# EAGLE board rev02 (EAGLE 7.5.0), part 1 of 2
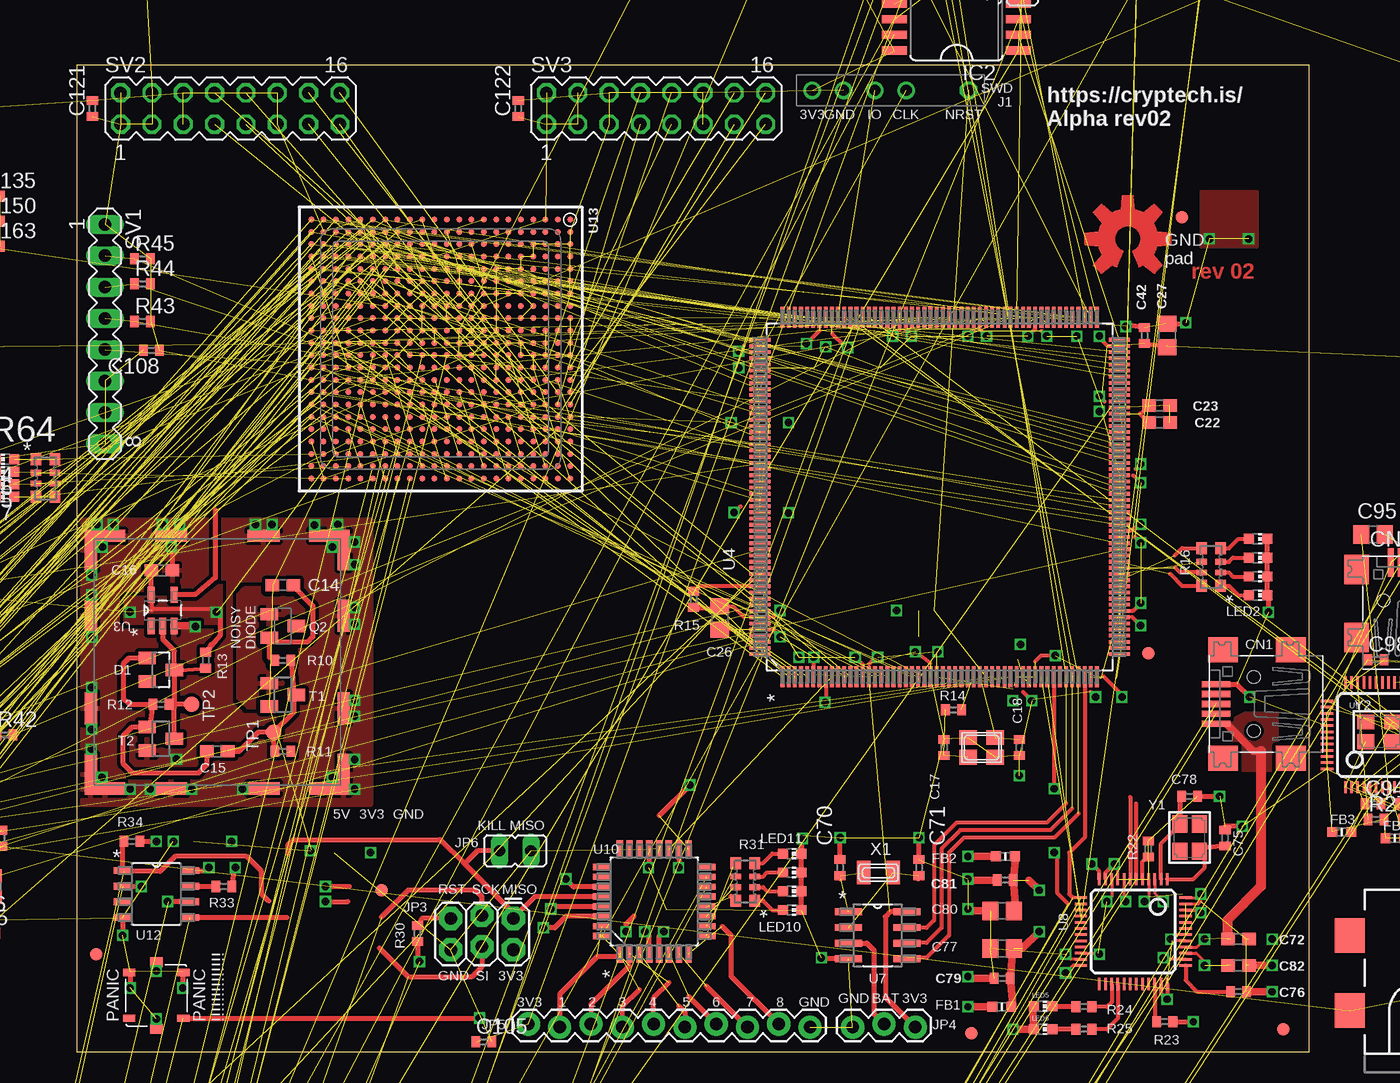
[diagram p26: board, top side]
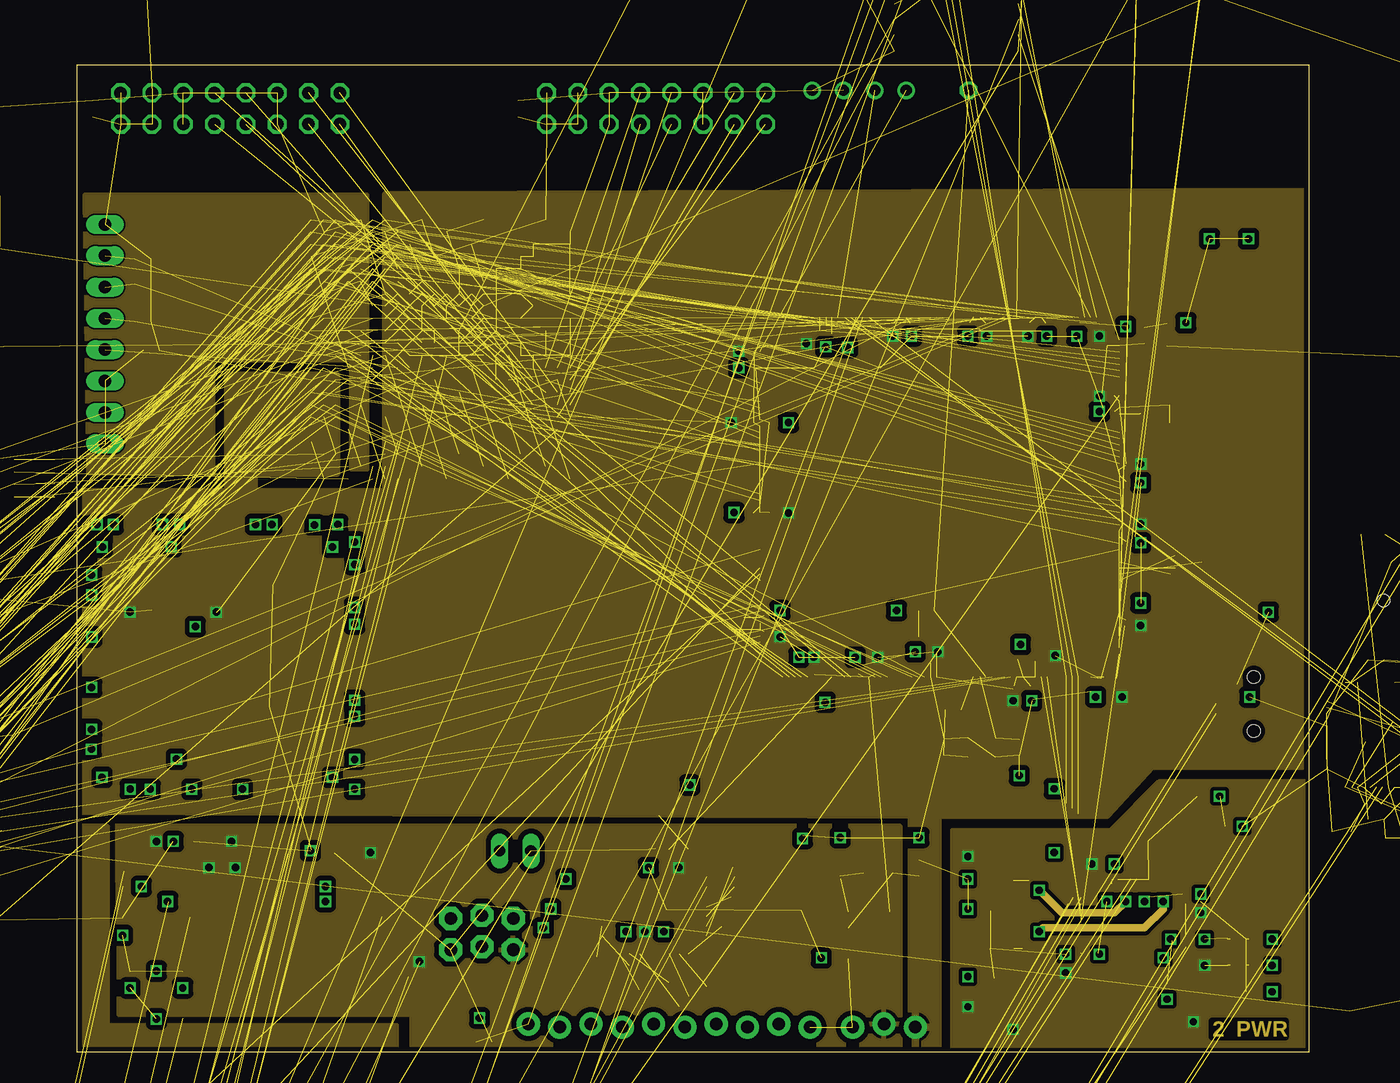
[diagram p27: board, inner layer POWER]
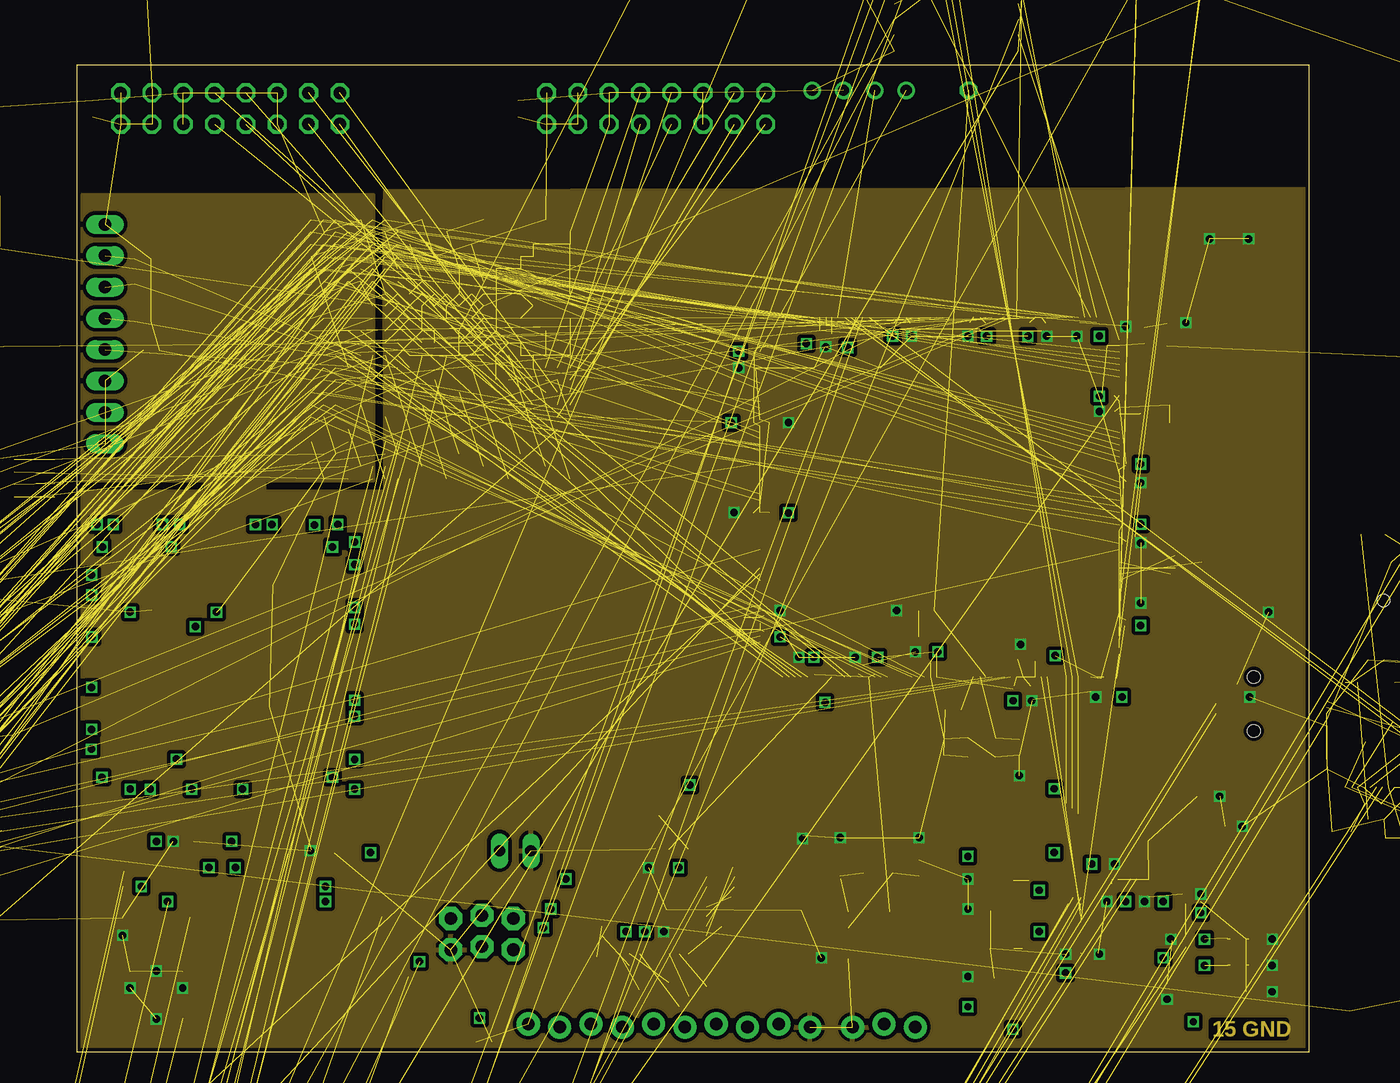
[diagram p28: board, inner layer GND]
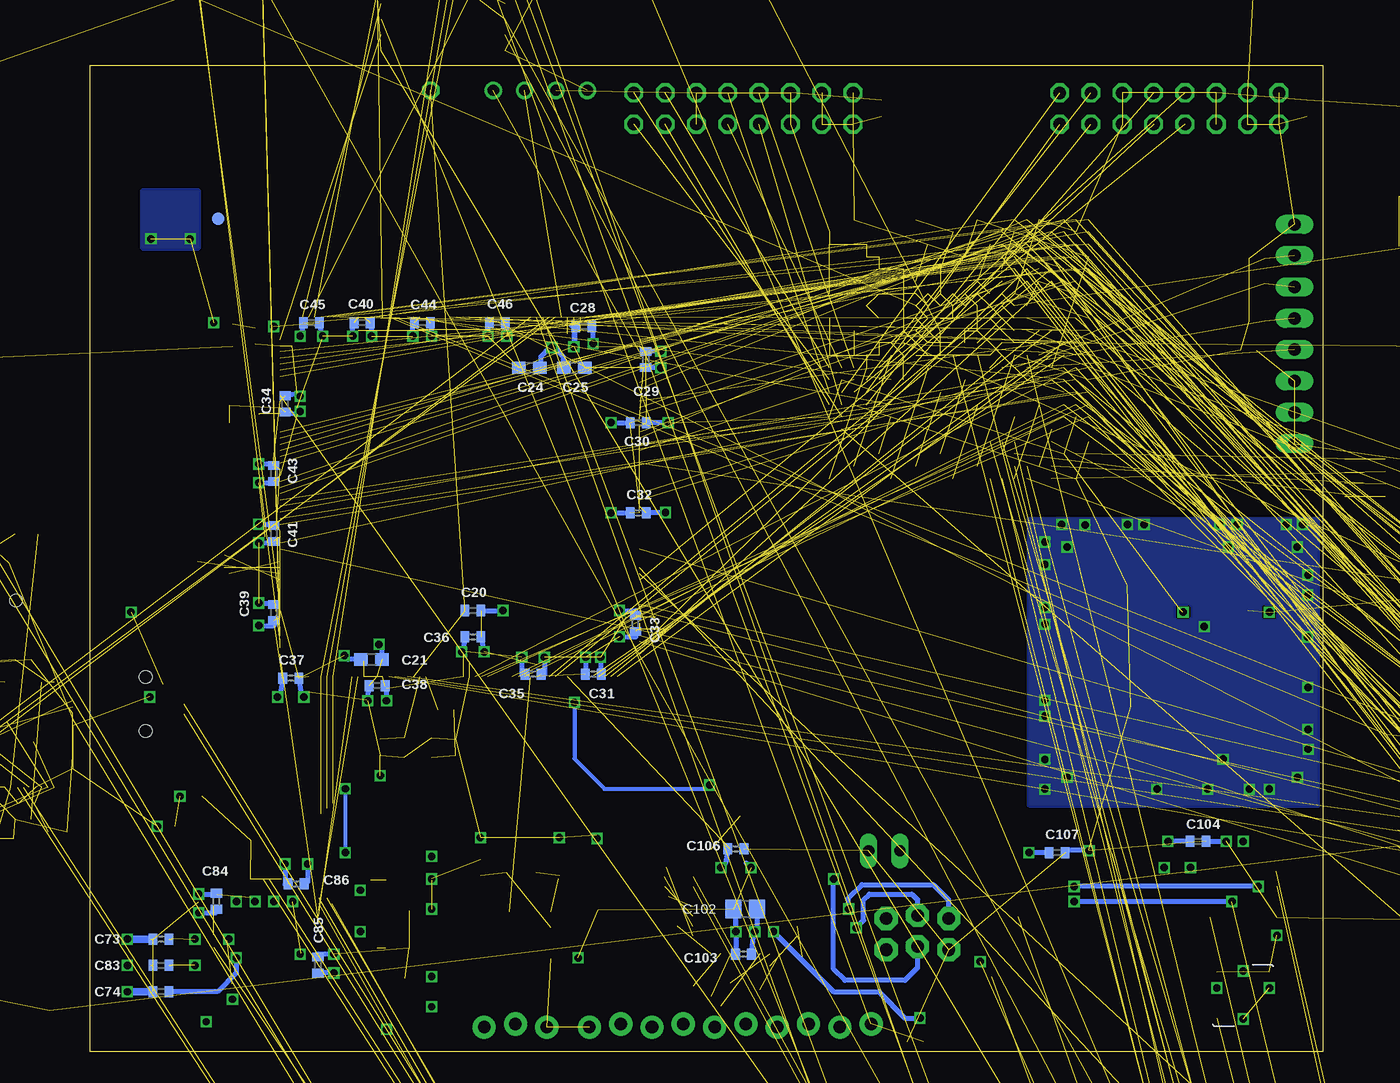
[diagram p29: board, bottom side, seen from below]

Size 100 x 80 mm. Coordinates in mm from the lower left corner, seen from the top.
Outline: 100,80 0,80 0,0 100,0 100,80
Copper layers (1*2*15*16): Top 0.035mm / dielectric 0.2mm / POWER 0.01706875mm / dielectric 1.2mm / GND 0.01706875mm / dielectric 0.2mm / Bottom 0.035mm
Design rules "dirt_cheap_dirty_boards.v1.FOUR_LAYERS": minimum track width 5mil, minimum drill 12mil, track to track 5mil, track to pad 5mil, pad to pad 5mil, via to via 5mil, smd to smd 0mil, copper to edge 10mil, drill to drill 10mil, minimum pad ring 10mil, minimum via ring 6mil, stop-mask expansion 2mil, vias tented up to drill 25mil, thermal gap 10mil
Net classes: 1 Ground: width 0.203 mm, drill 0.508 mm

## Footprints (pad centres in the part's own frame; a part is rotated, then mirrored left to right if it is on the bottom)
C1210 = smd 1.6 x 2.7: 1 -1.4,0; 2 1.4,0
C0402 = smd 0.7 x 0.9: 1 -0.65,0; 2 0.65,0
C0603 = smd 1.1 x 1: 1 -0.85,0; 2 0.85,0
CE-035X080 = drill 1.016 pad 1.93: + -1.905,0 | drill 1.016 pad 1.93 octagon: - 1.587,0
C0805 = smd 1.3 x 1.5: 1 -0.95,0; 2 0.95,0
SMC_D = smd 2.4 x 2.8: + -3.15,0; - 3.15,0
USB-MINIB = smd 0.5 x 2.308: D+ 0,4.064; D- -0.8,4.064; GND 1.6,4.064; ID 0.8,4.064; VBUS -1.6,4.064 | smd 2 x 2.4: GND1 -4.4,-2; GND2 -4.4,3.5; GND3 4.4,3.5; GND4 4.4,-2 | hole 1: -2.2,1; 2.2,1
SOT23 = smd 1 x 1.4: 1 -0.95,-1.1; 2 0.95,-1.1; 3 0,1.1
_0603MP = smd 0.8 x 0.8: 1 -0.762,0; 2 0.762,0
1206 = smd 1.35 x 1.2: 1 -1.675,0; 2 1.675,0
FIDUCIAL-1X2 = smd 1 x 1: 1 0,0
SO08 = smd 0.66 x 2.032: 1 -1.905,-3.073; 2 -0.635,-3.073; 3 0.635,-3.073; 4 1.905,-3.073; 5 1.905,3.073; 6 0.635,3.073; 7 -0.635,3.073; 8 -1.905,3.073
SO20W = smd 0.66 x 2.032: 1 -5.715,-5.029; 2 -4.445,-5.029; 3 -3.175,-5.029; 4 -1.905,-5.029; 5 -0.635,-5.029; 6 0.635,-5.029; 7 1.905,-5.029; 8 3.175,-5.029; 9 4.445,-5.029; 10 5.715,-5.029; 11 5.715,5.029; 12 4.445,5.029; 13 3.175,5.029; 14 1.905,5.029; 15 0.635,5.029; 16 -0.635,5.029; 17 -1.905,5.029; 18 -3.175,5.029; 19 -4.445,5.029; 20 -5.715,5.029
RCLAMP0502A = smd 0.9 x 0.4: 1 -1.2,0.5; 2 -1.2,0; 3 -1.2,-0.5; 4 1.2,-0.5; 5 1.2,0; 6 1.2,0.5
100MIL_THT = drill 0.9: P$GND 0,-5.08; P$SWDCLK 0,0; P$SWDIO 0,-2.54; P$VCC 0,-7.62 | drill 0.9 octagon: P$NRST 0,5.08
2X3-NS = drill 1.016 pad 1.88 square: 1 -2.54,-1.27 | drill 1.016 pad 1.88 octagon: 2 -2.54,1.27; 3 0,-1.27; 4 0,1.27; 5 2.54,-1.27; 6 2.54,1.27
POWER_JACK_SMD = smd 2.8 x 2.4: GND 0,-5.7; P$4 6.1,-5.7; VIN0 0,5.7; VIN1 6.1,5.7 | hole 2.032: 0,0; 4.572,0
JP1 = drill 0.914 long: 1 0,-1.27; 2 0,1.27
2X3_LOCK = drill 1.016 pad 1.88 octagon: 1 0,0; 2 0,2.54; 3 2.54,-0.254; 4 2.54,2.286; 5 5.08,0; 6 5.08,2.54
1X03_LOCK = drill 1.016 pad 1.88: 1 0,0.127; 2 2.54,-0.127; 3 5.08,0.127
1X10_LOCK = drill 1.016 pad 1.88: 1 0,0.127; 2 2.54,-0.127; 3 5.08,0.127; 4 7.62,-0.127; 5 10.16,0.127; 6 12.7,-0.127; 7 15.24,0.127; 8 17.78,-0.127; 9 20.32,0.127; 10 22.86,-0.127
CHIP-LED0603 = smd 0.8 x 0.8: A 0,-0.75; C 0,0.75
SOT23-BEC = smd 1 x 1.4: B -0.95,-1.1; C 0,1.1; E 0.95,-1.1
NX3225 = smd 1.4 x 1.2: 1 -1.1,-0.8; 2 1.1,-0.8; 3 1.1,0.8; 4 -1.1,0.8
ASF = smd 1.6 x 1.5: 1 -1.25,-1.15; 2 1.25,-1.15; 3 1.25,1.15; 4 -1.25,1.15
R0402 = smd 0.7 x 0.9: 1 -0.65,0; 2 0.65,0
RESCAXE80P320X160X60-8N = smd 0.864 x 0.965: 1 -0.762,1.524; 4 -0.762,-1.524; 5 0.762,-1.524; 8 0.762,1.524 | smd 0.864 x 0.457: 2 -0.762,0.432; 3 -0.762,-0.432; 6 0.762,-0.432; 7 0.762,0.432
R0603 = smd 1 x 1.1: 1 -0.85,0; 2 0.85,0
WE-SHC_36103205_NO_CREAM = smd 3.3 x 1: 1 10.37,10.25; 6 10.37,-10.25; 9 -7.83,-10.25; 14 -7.83,10.25 | smd 1 x 3.3: 2 11.52,9.1; 5 11.52,-9.1; 10 -8.98,-9.1; 13 -8.98,9.1 | smd 1 x 2.6: 3 11.52,3.75; 4 11.52,-3.75; 11 -8.98,-3.75; 12 -8.98,3.75 | smd 2.6 x 1: 7 5.02,-10.25; 8 -2.48,-10.25; 15 -2.48,10.25; 16 5.02,10.25
TACTILE_SWITCH = smd 0.6 x 1: A1 -1.85,2.2; A2 -1.85,-2.2; B1 1.85,2.2; B2 1.85,-2.2 | smd 0.8 x 1: G1 -2.7,0; G2 2.7,0
MA08-1 = drill 1.016 long: 1 -8.89,0; 2 -6.35,0; 3 -3.81,0; 4 -1.27,0; 5 1.27,0; 6 3.81,0; 7 6.35,0; 8 8.89,0
MA08-2 = drill 1.016 octagon: 1 -8.89,-1.27; 2 -8.89,1.27; 3 -6.35,-1.27; 4 -6.35,1.27; 5 -3.81,-1.27; 6 -3.81,1.27; 7 -1.27,-1.27; 8 -1.27,1.27; 9 1.27,-1.27; 10 1.27,1.27; 11 3.81,-1.27; 12 3.81,1.27; 13 6.35,-1.27; 14 6.35,1.27; 15 8.89,-1.27; 16 8.89,1.27
B1,27 = smd 1.27 x 1.27: TP 0,0
NDY = smd 0.86 x 2.41: 1 -6.35,0; 2 -5.08,0; 3 -3.81,0; 4 -2.54,0; 5 -1.27,0; 6 0,0; 7 1.27,0; 8 2.54,0; 9 3.81,0; 10 5.08,0; 11 6.35,0 | smd 9.126 x 13.37: TP1 0,9.5
TSOT-8-23 = smd 0.4 x 1.22: 1 -0.975,-1.3; 2 -0.325,-1.3; 3 0.325,-1.3; 4 0.975,-1.3; 5 0.975,1.3; 6 0.325,1.3; 7 -0.325,1.3; 8 -0.975,1.3
SOT95P275X110-5N = smd 1.321 x 0.559: 1 -1.27,0.94; 2 -1.27,0; 3 -1.27,-0.94; 4 1.27,-0.94; 5 1.27,0.94
LQFP-208 = smd 1.7 x 0.3: 1 -14.58,12.751; 2 -14.58,12.243; 3 -14.58,11.76; 4 -14.58,11.252; 5 -14.58,10.744; 6 -14.58,10.262; 7 -14.58,9.754; 8 -14.58,9.246; 9 -14.58,8.738; 10 -14.58,8.255; 11 -14.58,7.747; 12 -14.58,7.239; 13 -14.58,6.756; 14 -14.58,6.248; 15 -14.58,5.74; 16 -14.58,5.258; 17 -14.58,4.75; 18 -14.58,4.242; 19 -14.58,3.759; 20 -14.58,3.251; 21 -14.58,2.743; 22 -14.58,2.261; 23 -14.58,1.753; 24 -14.58,1.245; 25 -14.58,0.762; 26 -14.58,0.254; 27 -14.58,-0.254; 28 -14.58,-0.762; 29 -14.58,-1.245; 30 -14.58,-1.753; 31 -14.58,-2.261; 32 -14.58,-2.743; 33 -14.58,-3.251; 34 -14.58,-3.759; 35 -14.58,-4.242; 36 -14.58,-4.75; 37 -14.58,-5.258; 38 -14.58,-5.74; 39 -14.58,-6.248; 40 -14.58,-6.756; 41 -14.58,-7.239; 42 -14.58,-7.747; 43 -14.58,-8.255; 44 -14.58,-8.738; 45 -14.58,-9.246; 46 -14.58,-9.754; 47 -14.58,-10.262; 48 -14.58,-10.744; 49 -14.58,-11.252; 50 -14.58,-11.76; 51 -14.58,-12.243; 52 -14.58,-12.751; 105 14.58,-12.751; 106 14.58,-12.243; 107 14.58,-11.76; 108 14.58,-11.252; 109 14.58,-10.744; 110 14.58,-10.262; 111 14.58,-9.754; 112 14.58,-9.246; 113 14.58,-8.738; 114 14.58,-8.255; 115 14.58,-7.747; 116 14.58,-7.239; 117 14.58,-6.756; 118 14.58,-6.248; 119 14.58,-5.74; 120 14.58,-5.258; 121 14.58,-4.75; 122 14.58,-4.242; 123 14.58,-3.759; 124 14.58,-3.251; 125 14.58,-2.743; 126 14.58,-2.261; 127 14.58,-1.753; 128 14.58,-1.245; 129 14.58,-0.762; 130 14.58,-0.254; 131 14.58,0.254; 132 14.58,0.762; 133 14.58,1.245; 134 14.58,1.753; 135 14.58,2.261; 136 14.58,2.743; 137 14.58,3.251; 138 14.58,3.759; 139 14.58,4.242; 140 14.58,4.75; 141 14.58,5.258; 142 14.58,5.74; 143 14.58,6.248; 144 14.58,6.756; 145 14.58,7.239; 146 14.58,7.747; 147 14.58,8.255; 148 14.58,8.738; 149 14.58,9.246; 150 14.58,9.754; 151 14.58,10.262; 152 14.58,10.744; 153 14.58,11.252; 154 14.58,11.76; 155 14.58,12.243; 156 14.58,12.751 | smd 0.3 x 1.7: 53 -12.751,-14.58; 54 -12.243,-14.58; 55 -11.76,-14.58; 56 -11.252,-14.58; 57 -10.744,-14.58; 58 -10.262,-14.58; 59 -9.754,-14.58; 60 -9.246,-14.58; 61 -8.738,-14.58; 62 -8.255,-14.58; 63 -7.747,-14.58; 64 -7.239,-14.58; 65 -6.756,-14.58; 66 -6.248,-14.58; 67 -5.74,-14.58; 68 -5.258,-14.58; 69 -4.75,-14.58; 70 -4.242,-14.58; 71 -3.759,-14.58; 72 -3.251,-14.58; 73 -2.743,-14.58; 74 -2.261,-14.58; 75 -1.753,-14.58; 76 -1.245,-14.58; 77 -0.762,-14.58; 78 -0.254,-14.58; 79 0.254,-14.58; 80 0.762,-14.58; 81 1.245,-14.58; 82 1.753,-14.58; 83 2.261,-14.58; 84 2.743,-14.58; 85 3.251,-14.58; 86 3.759,-14.58; 87 4.242,-14.58; 88 4.75,-14.58; 89 5.258,-14.58; 90 5.74,-14.58; 91 6.248,-14.58; 92 6.756,-14.58; 93 7.239,-14.58; 94 7.747,-14.58; 95 8.255,-14.58; 96 8.738,-14.58; 97 9.246,-14.58; 98 9.754,-14.58; 99 10.262,-14.58; 100 10.744,-14.58; 101 11.252,-14.58; 102 11.76,-14.58; 103 12.243,-14.58; 104 12.751,-14.58; 157 12.751,14.58; 158 12.243,14.58; 159 11.76,14.58; 160 11.252,14.58; 161 10.744,14.58; 162 10.262,14.58; 163 9.754,14.58; 164 9.246,14.58; 165 8.738,14.58; 166 8.255,14.58; 167 7.747,14.58; 168 7.239,14.58; 169 6.756,14.58; 170 6.248,14.58; 171 5.74,14.58; 172 5.258,14.58; 173 4.75,14.58; 174 4.242,14.58; 175 3.759,14.58; 176 3.251,14.58; 177 2.743,14.58; 178 2.261,14.58; 179 1.753,14.58; 180 1.245,14.58; 181 0.762,14.58; 182 0.254,14.58; 183 -0.254,14.58; 184 -0.762,14.58; 185 -1.245,14.58; 186 -1.753,14.58; 187 -2.261,14.58; 188 -2.743,14.58; 189 -3.251,14.58; 190 -3.759,14.58; 191 -4.242,14.58; 192 -4.75,14.58; 193 -5.258,14.58; 194 -5.74,14.58; 195 -6.248,14.58; 196 -6.756,14.58; 197 -7.239,14.58; 198 -7.747,14.58; 199 -8.255,14.58; 200 -8.738,14.58; 201 -9.246,14.58; 202 -9.754,14.58; 203 -10.262,14.58; 204 -10.744,14.58; 205 -11.252,14.58; 206 -11.76,14.58; 207 -12.243,14.58; 208 -12.751,14.58
TSOP2-86L = smd 1.6 x 0.3: 1 -5.93,10.5; 2 -5.93,10; 3 -5.93,9.5; 4 -5.93,9; 5 -5.93,8.5; 6 -5.93,8; 7 -5.93,7.5; 8 -5.93,7; 9 -5.93,6.5; 10 -5.93,6; 11 -5.93,5.5; 12 -5.93,5; 13 -5.93,4.5; 14 -5.93,4; 15 -5.93,3.5; 16 -5.93,3; 17 -5.93,2.5; 18 -5.93,2; 19 -5.93,1.5; 20 -5.93,1; 21 -5.93,0.5; 22 -5.93,0; 23 -5.93,-0.5; 24 -5.93,-1; 25 -5.93,-1.5; 26 -5.93,-2; 27 -5.93,-2.5; 28 -5.93,-3; 29 -5.93,-3.5; 30 -5.93,-4; 31 -5.93,-4.5; 32 -5.93,-5; 33 -5.93,-5.5; 34 -5.93,-6; 35 -5.93,-6.5; 36 -5.93,-7; 37 -5.93,-7.5; 38 -5.93,-8; 39 -5.93,-8.5; 40 -5.93,-9; 41 -5.93,-9.5; 42 -5.93,-10; 43 -5.93,-10.5; 44 5.93,-10.5; 45 5.93,-10; 46 5.93,-9.5; 47 5.93,-9; 48 5.93,-8.5; 49 5.93,-8; 50 5.93,-7.5; 51 5.93,-7; 52 5.93,-6.5; 53 5.93,-6; 54 5.93,-5.5; 55 5.93,-5; 56 5.93,-4.5; 57 5.93,-4; 58 5.93,-3.5; 59 5.93,-3; 60 5.93,-2.5; 61 5.93,-2; 62 5.93,-1.5; 63 5.93,-1; 64 5.93,-0.5; 65 5.93,0; 66 5.93,0.5; 67 5.93,1; 68 5.93,1.5; 69 5.93,2; 70 5.93,2.5; 71 5.93,3; 72 5.93,3.5; 73 5.93,4; 74 5.93,4.5; 75 5.93,5; 76 5.93,5.5; 77 5.93,6; 78 5.93,6.5; 79 5.93,7; 80 5.93,7.5; 81 5.93,8; 82 5.93,8.5; 83 5.93,9; 84 5.93,9.5; 85 5.93,10; 86 5.93,10.5
SOIC127P600X175-8N = smd 2.184 x 0.559: 1 -2.362,1.905; 2 -2.362,0.635; 3 -2.362,-0.635; 4 -2.362,-1.905; 5 2.362,-1.905; 6 2.362,-0.635; 7 2.362,0.635; 8 2.362,1.905
FT2323HL_LQFP48 = smd 0.2 x 1: 1 -2.75,-4.25; 2 -2.25,-4.25; 3 -1.75,-4.25; 4 -1.25,-4.25; 5 -0.75,-4.25; 6 -0.25,-4.25; 7 0.25,-4.25; 8 0.75,-4.25; 9 1.25,-4.25; 10 1.75,-4.25; 11 2.25,-4.25; 12 2.75,-4.25; 25 2.75,4.25; 26 2.25,4.25; 27 1.75,4.25; 28 1.25,4.25; 29 0.75,4.25; 30 0.25,4.25; 31 -0.25,4.25; 32 -0.75,4.25; 33 -1.25,4.25; 34 -1.75,4.25; 35 -2.25,4.25; 36 -2.75,4.25 | smd 1 x 0.2: 13 4.25,-2.75; 14 4.25,-2.25; 15 4.25,-1.75; 16 4.25,-1.25; 17 4.25,-0.75; 18 4.25,-0.25; 19 4.25,0.25; 20 4.25,0.75; 21 4.25,1.25; 22 4.25,1.75; 23 4.25,2.25; 24 4.25,2.75; 37 -4.25,2.75; 38 -4.25,2.25; 39 -4.25,1.75; 40 -4.25,1.25; 41 -4.25,0.75; 42 -4.25,0.25; 43 -4.25,-0.25; 44 -4.25,-0.75; 45 -4.25,-1.25; 46 -4.25,-1.75; 47 -4.25,-2.25; 48 -4.25,-2.75
QFP80P900X900X120-32N = smd 1.473 x 0.508: 1 -4.242,2.794; 2 -4.242,2.007; 3 -4.242,1.194; 4 -4.242,0.406; 5 -4.242,-0.406; 6 -4.242,-1.194; 7 -4.242,-2.007; 8 -4.242,-2.794; 17 4.242,-2.794; 18 4.242,-2.007; 19 4.242,-1.194; 20 4.242,-0.406; 21 4.242,0.406; 22 4.242,1.194; 23 4.242,2.007; 24 4.242,2.794 | smd 0.508 x 1.473: 9 -2.794,-4.242; 10 -2.007,-4.242; 11 -1.194,-4.242; 12 -0.406,-4.242; 13 0.406,-4.242; 14 1.194,-4.242; 15 2.007,-4.242; 16 2.794,-4.242; 25 2.794,4.242; 26 2.007,4.242; 27 1.194,4.242; 28 0.406,4.242; 29 -0.406,4.242; 30 -1.194,4.242; 31 -2.007,4.242; 32 -2.794,4.242
SOIC127P600X175-8N' = smd 1.473 x 0.559: 1 -2.718,1.905; 2 -2.718,0.635; 3 -2.718,-0.635; 4 -2.718,-1.905; 5 2.718,-1.905; 6 2.718,-0.635; 7 2.718,0.635; 8 2.718,1.905
FF484 = smd 0.5 x 0.5: A1 -10.5,10.5; A2 -9.5,10.5; A3 -8.5,10.5; A4 -7.5,10.5; A5 -6.5,10.5; A6 -5.5,10.5; A7 -4.5,10.5; A8 -3.5,10.5; A9 -2.5,10.5; A10 -1.5,10.5; A11 -0.5,10.5; A12 0.5,10.5; A13 1.5,10.5; A14 2.5,10.5; A15 3.5,10.5; A16 4.5,10.5; A17 5.5,10.5; A18 6.5,10.5; A19 7.5,10.5; A20 8.5,10.5; A21 9.5,10.5; A22 10.5,10.5; AA1 -10.5,-9.5; AA2 -9.5,-9.5; AA3 -8.5,-9.5; AA4 -7.5,-9.5; AA5 -6.5,-9.5; AA6 -5.5,-9.5; AA7 -4.5,-9.5; AA8 -3.5,-9.5; AA9 -2.5,-9.5; AA10 -1.5,-9.5; AA11 -0.5,-9.5; AA12 0.5,-9.5; AA13 1.5,-9.5; AA14 2.5,-9.5; AA15 3.5,-9.5; AA16 4.5,-9.5; AA17 5.5,-9.5; AA18 6.5,-9.5; AA19 7.5,-9.5; AA20 8.5,-9.5; AA21 9.5,-9.5; AA22 10.5,-9.5; AB1 -10.5,-10.5; AB2 -9.5,-10.5; AB3 -8.5,-10.5; AB4 -7.5,-10.5; AB5 -6.5,-10.5; AB6 -5.5,-10.5; AB7 -4.5,-10.5; AB8 -3.5,-10.5; AB9 -2.5,-10.5; AB10 -1.5,-10.5; AB11 -0.5,-10.5; AB12 0.5,-10.5; AB13 1.5,-10.5; AB14 2.5,-10.5; AB15 3.5,-10.5; AB16 4.5,-10.5; AB17 5.5,-10.5; AB18 6.5,-10.5; AB19 7.5,-10.5; AB20 8.5,-10.5; AB21 9.5,-10.5; AB22 10.5,-10.5; B1 -10.5,9.5; B2 -9.5,9.5; B3 -8.5,9.5; B4 -7.5,9.5; B5 -6.5,9.5; B6 -5.5,9.5; B7 -4.5,9.5; B8 -3.5,9.5; B9 -2.5,9.5; B10 -1.5,9.5; B11 -0.5,9.5; B12 0.5,9.5; B13 1.5,9.5; B14 2.5,9.5; B15 3.5,9.5; B16 4.5,9.5; B17 5.5,9.5; B18 6.5,9.5; B19 7.5,9.5; B20 8.5,9.5; B21 9.5,9.5; B22 10.5,9.5; C1 -10.5,8.5; C2 -9.5,8.5; C3 -8.5,8.5; C4 -7.5,8.5; C5 -6.5,8.5; C6 -5.5,8.5; C7 -4.5,8.5; C8 -3.5,8.5; C9 -2.5,8.5; C10 -1.5,8.5; C11 -0.5,8.5; C12 0.5,8.5; C13 1.5,8.5; C14 2.5,8.5; C15 3.5,8.5; C16 4.5,8.5; C17 5.5,8.5; C18 6.5,8.5; C19 7.5,8.5; C20 8.5,8.5; C21 9.5,8.5; C22 10.5,8.5; D1 -10.5,7.5; D2 -9.5,7.5; D3 -8.5,7.5; D4 -7.5,7.5; D5 -6.5,7.5; D6 -5.5,7.5; D7 -4.5,7.5; D8 -3.5,7.5; D9 -2.5,7.5; D10 -1.5,7.5; D11 -0.5,7.5; D12 0.5,7.5; D13 1.5,7.5; D14 2.5,7.5; D15 3.5,7.5; D16 4.5,7.5; D17 5.5,7.5; D18 6.5,7.5; D19 7.5,7.5; D20 8.5,7.5; D21 9.5,7.5; D22 10.5,7.5; E1 -10.5,6.5; E2 -9.5,6.5; E3 -8.5,6.5; E4 -7.5,6.5; E5 -6.5,6.5; E6 -5.5,6.5; E7 -4.5,6.5; E8 -3.5,6.5; E9 -2.5,6.5; E10 -1.5,6.5; E11 -0.5,6.5; E12 0.5,6.5; E13 1.5,6.5; E14 2.5,6.5; E15 3.5,6.5; E16 4.5,6.5; E17 5.5,6.5; E18 6.5,6.5; E19 7.5,6.5; E20 8.5,6.5; E21 9.5,6.5; E22 10.5,6.5; F1 -10.5,5.5; F2 -9.5,5.5; F3 -8.5,5.5; F4 -7.5,5.5; F5 -6.5,5.5; F6 -5.5,5.5; F7 -4.5,5.5; F8 -3.5,5.5; F9 -2.5,5.5; F10 -1.5,5.5; F11 -0.5,5.5; F12 0.5,5.5; F13 1.5,5.5; F14 2.5,5.5; F15 3.5,5.5; F16 4.5,5.5; F17 5.5,5.5; F18 6.5,5.5; F19 7.5,5.5; F20 8.5,5.5; F21 9.5,5.5; F22 10.5,5.5; G1 -10.5,4.5; G2 -9.5,4.5; G3 -8.5,4.5; G4 -7.5,4.5; G5 -6.5,4.5; G6 -5.5,4.5; G7 -4.5,4.5; G8 -3.5,4.5; G9 -2.5,4.5; G10 -1.5,4.5; G11 -0.5,4.5; G12 0.5,4.5; G13 1.5,4.5; G14 2.5,4.5; G15 3.5,4.5; G16 4.5,4.5; G17 5.5,4.5; G18 6.5,4.5; G19 7.5,4.5; G20 8.5,4.5; G21 9.5,4.5; G22 10.5,4.5; H1 -10.5,3.5; H2 -9.5,3.5; H3 -8.5,3.5; H4 -7.5,3.5; H5 -6.5,3.5; H6 -5.5,3.5; H7 -4.5,3.5; H8 -3.5,3.5; H9 -2.5,3.5; H10 -1.5,3.5; H11 -0.5,3.5; H12 0.5,3.5; H13 1.5,3.5; H14 2.5,3.5; H15 3.5,3.5; H16 4.5,3.5; H17 5.5,3.5; H18 6.5,3.5; H19 7.5,3.5; H20 8.5,3.5; H21 9.5,3.5; H22 10.5,3.5; J1 -10.5,2.5; J2 -9.5,2.5; J3 -8.5,2.5; J4 -7.5,2.5; J5 -6.5,2.5; J6 -5.5,2.5; J7 -4.5,2.5; J8 -3.5,2.5; J9 -2.5,2.5; J10 -1.5,2.5; J11 -0.5,2.5; J12 0.5,2.5; J13 1.5,2.5; J14 2.5,2.5; J15 3.5,2.5; J16 4.5,2.5; J17 5.5,2.5; J18 6.5,2.5; J19 7.5,2.5; J20 8.5,2.5; J21 9.5,2.5; J22 10.5,2.5; K1 -10.5,1.5; K2 -9.5,1.5; K3 -8.5,1.5; K4 -7.5,1.5; K5 -6.5,1.5; K6 -5.5,1.5; K7 -4.5,1.5; K8 -3.5,1.5; K9 -2.5,1.5; K10 -1.5,1.5; K11 -0.5,1.5; K12 0.5,1.5; K13 1.5,1.5; K14 2.5,1.5; K15 3.5,1.5; K16 4.5,1.5; K17 5.5,1.5; K18 6.5,1.5; K19 7.5,1.5; K20 8.5,1.5; K21 9.5,1.5; K22 10.5,1.5; L1 -10.5,0.5; L2 -9.5,0.5; L3 -8.5,0.5; L4 -7.5,0.5; L5 -6.5,0.5; L6 -5.5,0.5; L7 -4.5,0.5; L8 -3.5,0.5; L9 -2.5,0.5; L10 -1.5,0.5; L11 -0.5,0.5; L12 0.5,0.5; L13 1.5,0.5; L14 2.5,0.5; L15 3.5,0.5; L16 4.5,0.5; L17 5.5,0.5; L18 6.5,0.5; L19 7.5,0.5; L20 8.5,0.5; L21 9.5,0.5; L22 10.5,0.5; M1 -10.5,-0.5; M2 -9.5,-0.5; M3 -8.5,-0.5; M4 -7.5,-0.5; M5 -6.5,-0.5; M6 -5.5,-0.5; M7 -4.5,-0.5; M8 -3.5,-0.5; M9 -2.5,-0.5; M10 -1.5,-0.5; M11 -0.5,-0.5; M12 0.5,-0.5; M13 1.5,-0.5; M14 2.5,-0.5; M15 3.5,-0.5; M16 4.5,-0.5; M17 5.5,-0.5; M18 6.5,-0.5; M19 7.5,-0.5; M20 8.5,-0.5; M21 9.5,-0.5; M22 10.5,-0.5; N1 -10.5,-1.5; N2 -9.5,-1.5; N3 -8.5,-1.5; N4 -7.5,-1.5; N5 -6.5,-1.5; N6 -5.5,-1.5; N7 -4.5,-1.5; N8 -3.5,-1.5; N9 -2.5,-1.5; N10 -1.5,-1.5; N11 -0.5,-1.5; N12 0.5,-1.5; N13 1.5,-1.5; N14 2.5,-1.5; N15 3.5,-1.5; N16 4.5,-1.5; N17 5.5,-1.5; N18 6.5,-1.5; N19 7.5,-1.5; N20 8.5,-1.5; N21 9.5,-1.5; N22 10.5,-1.5; P1 -10.5,-2.5; P2 -9.5,-2.5; P3 -8.5,-2.5; P4 -7.5,-2.5; P5 -6.5,-2.5; P6 -5.5,-2.5; P7 -4.5,-2.5; P8 -3.5,-2.5; P9 -2.5,-2.5; P10 -1.5,-2.5; P11 -0.5,-2.5; P12 0.5,-2.5; P13 1.5,-2.5; P14 2.5,-2.5; P15 3.5,-2.5; P16 4.5,-2.5; P17 5.5,-2.5; P18 6.5,-2.5; P19 7.5,-2.5; P20 8.5,-2.5; P21 9.5,-2.5; P22 10.5,-2.5; R1 -10.5,-3.5; R2 -9.5,-3.5; R3 -8.5,-3.5; R4 -7.5,-3.5; R5 -6.5,-3.5; R6 -5.5,-3.5; R7 -4.5,-3.5; R8 -3.5,-3.5; R9 -2.5,-3.5; R10 -1.5,-3.5; R11 -0.5,-3.5; R12 0.5,-3.5; R13 1.5,-3.5; R14 2.5,-3.5; R15 3.5,-3.5; R16 4.5,-3.5; R17 5.5,-3.5; R18 6.5,-3.5; R19 7.5,-3.5; R20 8.5,-3.5; R21 9.5,-3.5; R22 10.5,-3.5; T1 -10.5,-4.5; T2 -9.5,-4.5; T3 -8.5,-4.5; T4 -7.5,-4.5; T5 -6.5,-4.5; T6 -5.5,-4.5; T7 -4.5,-4.5; T8 -3.5,-4.5; T9 -2.5,-4.5; T10 -1.5,-4.5; T11 -0.5,-4.5; T12 0.5,-4.5; T13 1.5,-4.5; T14 2.5,-4.5; T15 3.5,-4.5; T16 4.5,-4.5; T17 5.5,-4.5; T18 6.5,-4.5; T19 7.5,-4.5; T20 8.5,-4.5; T21 9.5,-4.5; T22 10.5,-4.5; U1 -10.5,-5.5; U2 -9.5,-5.5; U3 -8.5,-5.5; U4 -7.5,-5.5; U5 -6.5,-5.5; U6 -5.5,-5.5; U7 -4.5,-5.5; U8 -3.5,-5.5; U9 -2.5,-5.5; U10 -1.5,-5.5; U11 -0.5,-5.5; U12 0.5,-5.5; U13 1.5,-5.5; U14 2.5,-5.5; U15 3.5,-5.5; U16 4.5,-5.5; U17 5.5,-5.5; U18 6.5,-5.5; U19 7.5,-5.5; U20 8.5,-5.5; U21 9.5,-5.5; U22 10.5,-5.5; V1 -10.5,-6.5; V2 -9.5,-6.5; V3 -8.5,-6.5; V4 -7.5,-6.5; V5 -6.5,-6.5; V6 -5.5,-6.5; V7 -4.5,-6.5; V8 -3.5,-6.5; V9 -2.5,-6.5; V10 -1.5,-6.5; V11 -0.5,-6.5; V12 0.5,-6.5; V13 1.5,-6.5; V14 2.5,-6.5; V15 3.5,-6.5; V16 4.5,-6.5; V17 5.5,-6.5; V18 6.5,-6.5; V19 7.5,-6.5; V20 8.5,-6.5; V21 9.5,-6.5; V22 10.5,-6.5; W1 -10.5,-7.5; W2 -9.5,-7.5; W3 -8.5,-7.5; W4 -7.5,-7.5; W5 -6.5,-7.5; W6 -5.5,-7.5; W7 -4.5,-7.5; W8 -3.5,-7.5; W9 -2.5,-7.5; W10 -1.5,-7.5; W11 -0.5,-7.5; W12 0.5,-7.5; W13 1.5,-7.5; W14 2.5,-7.5; W15 3.5,-7.5; W16 4.5,-7.5; W17 5.5,-7.5; W18 6.5,-7.5; W19 7.5,-7.5; W20 8.5,-7.5; W21 9.5,-7.5; W22 10.5,-7.5; Y1 -10.5,-8.5; Y2 -9.5,-8.5; Y3 -8.5,-8.5; Y4 -7.5,-8.5; Y5 -6.5,-8.5; Y6 -5.5,-8.5; Y7 -4.5,-8.5; Y8 -3.5,-8.5; Y9 -2.5,-8.5; Y10 -1.5,-8.5; Y11 -0.5,-8.5; Y12 0.5,-8.5; Y13 1.5,-8.5; Y14 2.5,-8.5; Y15 3.5,-8.5; Y16 4.5,-8.5; Y17 5.5,-8.5; Y18 6.5,-8.5; Y19 7.5,-8.5; Y20 8.5,-8.5; Y21 9.5,-8.5; Y22 10.5,-8.5
QFN38_4X7X1.85 = smd 0.6 x 0.25: 1 -3.4,1.25; 2 -3.4,0.75; 3 -3.4,0.25; 4 -3.4,-0.25; 5 -3.4,-0.75; 6 -3.4,-1.25; 20 3.4,-1.25; 21 3.4,-0.75; 22 3.4,-0.25; 23 3.4,0.25; 24 3.4,0.75; 25 3.4,1.25 | smd 0.25 x 0.6: 7 -3,-1.9; 8 -2.5,-1.9; 9 -2,-1.9; 10 -1.5,-1.9; 11 -1,-1.9; 12 -0.5,-1.9; 13 0,-1.9; 14 0.5,-1.9; 15 1,-1.9; 16 1.5,-1.9; 17 2,-1.9; 18 2.5,-1.9; 19 3,-1.9; 26 3,1.9; 27 2.5,1.9; 28 2,1.9; 29 1.5,1.9; 30 1,1.9; 31 0.5,1.9; 32 0,1.9; 33 -0.5,1.9; 34 -1,1.9; 35 -1.5,1.9; 36 -2,1.9; 37 -2.5,1.9; 38 -3,1.9 | smd 0.97 x 0.78: P$39 1.255,0.565; P$40 1.255,-0.565
QFN68_8X11X1.85 = smd 0.6 x 0.25: 1 -5.5,3.5; 2 -5.5,3; 3 -5.5,2.5; 4 -5.5,2; 5 -5.5,1.5; 6 -5.5,1; 7 -5.5,0.5; 8 -5.5,0; 9 -5.5,-0.5; 10 -5.5,-1; 11 -5.5,-1.5; 12 -5.5,-2; 13 -5.5,-2.5; 14 -5.5,-3; 15 -5.5,-3.5; 35 5.5,-3.5; 36 5.5,-3; 37 5.5,-2.5; 38 5.5,-2; 39 5.5,-1.5; 40 5.5,-1; 41 5.5,-0.5; 42 5.5,0; 43 5.5,0.5; 44 5.5,1; 45 5.5,1.5; 46 5.5,2; 47 5.5,2.5; 48 5.5,3; 49 5.5,3.5 | smd 0.25 x 0.6: 16 -4.5,-3.9; 17 -4,-3.9; 18 -3.5,-3.9; 19 -3,-3.9; 20 -2.5,-3.9; 21 -2,-3.9; 22 -1.5,-3.9; 23 -1,-3.9; 24 -0.5,-3.9; 25 0,-3.9; 26 0.5,-3.9; 27 1,-3.9; 28 1.5,-3.9; 29 2,-3.9; 30 2.5,-3.9; 31 3,-3.9; 32 3.5,-3.9; 33 4,-3.9; 34 4.5,-3.9; 50 4.5,3.9; 51 4,3.9; 52 3.5,3.9; 53 3,3.9; 54 2.5,3.9; 55 2,3.9; 56 1.5,3.9; 57 1,3.9; 58 0.5,3.9; 59 0,3.9; 60 -0.5,3.9; 61 -1,3.9; 62 -1.5,3.9; 63 -2,3.9; 64 -2.5,3.9; 65 -3,3.9; 66 -3.5,3.9; 67 -4,3.9; 68 -4.5,3.9 | smd 1.175 x 1.605: P$69 2.175,-1.8; P$70 2.175,0.55 | smd 1.3 x 0.75: P$71 -3.55,2.65
XTAL3215 = smd 1.1 x 1.9: P$1 1.2,0; P$2 -1.2,0
CRYSTAL_3.2X2.5 = smd 1.4 x 1.2: 1 -1.1,-0.8; 2 1.1,0.8; GND1 -1.1,0.8; GND2 1.1,-0.8

## Placement (x,y rotation side)
C1  10 uF  [C1210]  124.2,12.49 0 top  (outside the outline)
C2  10 uF  [C1210]  124.2,9.44 0 top  (outside the outline)
C3  10 uF  [C1210]  124.2,6.39 0 top  (outside the outline)
C4  0.047 uF  [C0402]  119.12,6.39 0 top  (outside the outline)
C5  0.47 uF  [C0603]  135.28,21.74 0 top  (outside the outline)
C6  0.047 uF  [C0402]  129.28,6.39 0 top  (outside the outline)
C7  4.7 uF  [C0603]  -6.59,13.41 90 top  (outside the outline)
C8  47 uF  [C1210]  135.99,17.77 0 top  (outside the outline)
C9  330 uF  [CE-035X080]  137.51,31.39 180 top  (outside the outline)
C10  330 uF  [CE-035X080]  137.51,25.29 180 top  (outside the outline)
C11  0.01 uF  [C0402]  -9.4,13.25 0 top  (outside the outline)
C12  0.01 uF  [C0402]  -12.19,16.55 270 top  (outside the outline)
C13  4.7 uF  [C0603]  -14.48,15.79 90 top  (outside the outline)
C14  0.1 uF  [C0603]  16.72,37.83 0 top
C15  0.1 uF  [C0603]  11.39,24.37 180 top
C16  0.1 uF  [C0603]  6.91,39.05 180 top
C17  5 pF  [C0402]  70.36,24.68 270 top
C18  5 pF  [C0402]  76.45,24.68 90 top
C19  0.1 uF  [C0402]  -10.42,24.43 180 top  (outside the outline)
C20  0.1 uF  [C0402]  68.93,35.78 0 bottom
C21  1 uF  [C0603]  77.16,31.82 0 bottom
C22  2.2 uF  [C0603]  87.83,51.02 180 top
C23  2.2 uF  [C0603]  87.83,52.42 180 top
C24  2.2 uF  [C0603]  64.36,55.47 0 bottom
C25  2.2 uF  [C0603]  60.7,55.47 180 bottom
C26  10 uF  [C0805]  52.17,35.18 90 top
C27  10 uF  [C0805]  88.44,58.08 90 top
C28  0.1 uF  [C0402]  59.94,58.82 180 bottom
C29  0.1 uF  [C0402]  54.91,56.13 270 bottom
C30  0.1 uF  [C0402]  55.52,51.02 180 bottom
C31  0.1 uF  [C0402]  59.18,30.63 0 bottom
C32  0.1 uF  [C0402]  55.52,43.71 0 bottom
C33  0.1 uF  [C0402]  55.75,34.74 90 bottom
C34  0.1 uF  [C0402]  84.17,52.55 270 bottom
C35  0.1 uF  [C0402]  64.06,30.63 0 bottom
C36  0.1 uF  [C0402]  68.93,33.65 0 bottom
C37  0.1 uF  [C0402]  83.72,30.3 0 bottom
C38  0.1 uF  [C0402]  76.71,29.69 180 bottom
C39  0.1 uF  [C0402]  85.09,35.63 90 bottom
C40  0.1 uF  [C0402]  77.92,59.12 180 bottom
C41  0.1 uF  [C0402]  85.09,42.03 270 bottom
C42  0.1 uF  [C0402]  86.61,58.08 90 top
C43  0.1 uF  [C0402]  85.09,46.91 270 bottom
C44  0.1 uF  [C0402]  73.05,59.12 0 bottom
C45  0.1 uF  [C0402]  82.04,59.12 0 bottom
C46  0.1 uF  [C0402]  66.95,59.12 180 bottom
C47  0.1 uF  [C0402]  -32.26,-9.1 0 top  (outside the outline)
C48  0.1 uF  [C0402]  -25.15,-4.27 0 top  (outside the outline)
C49  0.1 uF  [C0402]  -25.66,-18.75 0 top  (outside the outline)
C50  0.1 uF  [C0402]  -32.26,-4.27 0 top  (outside the outline)
C51  0.1 uF  [C0402]  -32.26,-18.75 0 top  (outside the outline)
C52  0.1 uF  [C0402]  -25.66,-13.93 0 top  (outside the outline)
C53  0.1 uF  [C0402]  -32.26,-28.4 0 top  (outside the outline)
C54  0.1 uF  [C0402]  -32.26,-13.93 0 top  (outside the outline)
C55  0.1 uF  [C0402]  -25.66,-23.58 0 top  (outside the outline)
C56  0.1 uF  [C0402]  -25.15,-9.1 0 top  (outside the outline)
C57  0.1 uF  [C0402]  -32.26,-23.58 0 top  (outside the outline)
C58  0.1 uF  [C0402]  -25.15,-60.92 0 top  (outside the outline)
C59  0.1 uF  [C0402]  -32.26,-60.92 0 top  (outside the outline)
C60  0.1 uF  [C0402]  -12.45,-65.74 0 top  (outside the outline)
C61  0.1 uF  [C0402]  -18.8,-33.23 0 top  (outside the outline)
C62  0.1 uF  [C0402]  -19.05,-65.74 0 top  (outside the outline)
C63  0.1 uF  [C0402]  -25.66,-65.74 0 top  (outside the outline)
C64  0.1 uF  [C0402]  -19.05,-70.57 0 top  (outside the outline)
C65  0.1 uF  [C0402]  -32.26,-65.74 0 top  (outside the outline)
C66  0.1 uF  [C0402]  -25.66,-70.57 0 top  (outside the outline)
C67  0.1 uF  [C0402]  -18.04,-60.92 0 top  (outside the outline)
C68  0.1 uF  [C0402]  -32.26,-70.57 0 top  (outside the outline)
C69  0.1 uF  [C0402]  95.5,97.83 180 top  (outside the outline)
C70  5 pF  [C0402]  61.92,14.93 270 top
C71  5 pF  [C0402]  68.32,14.93 270 top
C72  4.7 uF  [C0603]  94.23,9.14 0 top
C73  0.1 uF  [C0402]  94.23,9.14 180 bottom
C74  0.1 uF  [C0402]  94.23,4.87 180 bottom
C75  5 pF  [C0402]  93.15,17.34 270 top
C76  0.1 uF  [C0402]  94.23,4.87 0 top
C77  10 uF  [C0805]  75.07,8.39 180 top
C78  5 pF  [C0402]  90.27,20.72 180 top
C79  0.1 uF  [C0402]  75.07,5.95 180 top
C80  10 uF  [C0805]  75.07,11.43 180 top
C81  0.1 uF  [C0402]  75.31,13.93 180 top
C82  4.7 uF  [C0603]  94.23,7 0 top
C83  0.1 uF  [C0402]  94.23,7 180 bottom
C84  0.1 uF  [C0402]  89.74,12.2 90 bottom
C85  0.1 uF  [C0402]  81.51,7.02 90 bottom
C86  0.1 uF  [C0402]  83.28,13.63 180 bottom
C87  4.7 uF  [C0603]  109.73,41.7 0 top  (outside the outline)
C88  0.1 uF  [C0402]  112.52,41.19 0 top  (outside the outline)
C89  0.1 uF  [C0402]  112.01,25.19 0 top  (outside the outline)
C90  5 pF  [C0402]  108.2,18.84 0 top  (outside the outline)
C91  0.1 uF  [C0402]  112.27,23.67 0 top  (outside the outline)
C92  10 uF  [C0805]  112.52,27.48 0 top  (outside the outline)
C93  5 pF  [C0402]  112.77,17.32 0 top  (outside the outline)
C94  0.1 uF  [C0402]  105.15,20.11 0 top  (outside the outline)
C95  10 uF  [C0805]  105.15,41.95 0 top  (outside the outline)
C96  0.1 uF  [C0402]  112.52,18.59 0 top  (outside the outline)
C97  4.7 uF  [C0603]  112.52,22.14 0 top  (outside the outline)
C98  0.1 uF  [C0402]  105.41,31.79 0 top  (outside the outline)
C99  0.1 uF  [C0402]  108.71,31.54 0 top  (outside the outline)
C100  0.1 uF  [C0402]  107.95,20.11 0 top  (outside the outline)
C101  0.1 uF  [C0402]  109.73,17.32 0 top  (outside the outline)
C102  10 uF  [C0805]  46.83,11.58 180 bottom
C103  0.1 uF  [C0402]  46.99,7.92 180 bottom
C104  0.1 uF  [C0402]  10.11,17.06 0 bottom
C105  0.1 uF  [C0402]  33.02,0.81 0 top
C106  0.1 uF  [C0402]  47.6,16.45 0 bottom
C107  0.1 uF  [C0402]  21.54,16.15 0 bottom
C108  0.1 uF  [C0402]  6.04,56.89 180 top
C109  0.1 uF  [C0402]  52.93,99.71 0 top  (outside the outline)
C110  0.1 uF  [C0402]  -21.34,-88.35 0 top  (outside the outline)
C111  0.01 uF  [C0402]  58.67,100.37 0 top  (outside the outline)
C112  0.1 uF  [C0402]  76.96,95.8 0 top  (outside the outline)
C113  22 uF  [C1210]  121.16,63.04 0 top  (outside the outline)
C114  22 uF  [C1210]  121.16,48.81 180 top  (outside the outline)
C115  0.047 uF  [C0402]  120.14,70.15 0 top  (outside the outline)
C116  0.047 uF  [C0402]  120.14,55.92 0 top  (outside the outline)
C117  27pF  [C0402]  132.33,65.07 0 top  (outside the outline)
C118  27pF  [C0402]  132.33,50.84 0 top  (outside the outline)
C119  47 uF  [C1210]  137.41,66.08 0 top  (outside the outline)
C120  47 uF  [C1210]  137.41,51.86 0 top  (outside the outline)
C121  0.1 uF  [C0402]  1.27,76.5 90 top
C122  0.1 uF  [C0402]  35.81,76.5 90 top
C123  330 uF  [SMC_D]  -15.8,100.27 0 top  (outside the outline)
C124  0.47 uF  [C0402]  -16,82.59 0 top  (outside the outline)
C125  0.47 uF  [C0402]  -16,69.39 0 top  (outside the outline)
C126  47 uF  [C1210]  -14.99,52.11 0 top  (outside the outline)
C127  330 uF  [SMC_D]  -6.96,100.27 0 top  (outside the outline)
C128  0.47 uF  [C0402]  -12.96,82.59 0 top  (outside the outline)
C129  0.47 uF  [C0402]  -12.96,69.39 0 top  (outside the outline)
C130  0.47 uF  [C0402]  -16,80.56 0 top  (outside the outline)
C131  0.47 uF  [C0402]  -9.91,69.39 0 top  (outside the outline)
C132  4.7 uF  [C0603]  -16,59.23 0 top  (outside the outline)
C133  47 uF  [C1210]  -14.68,93.16 0 top  (outside the outline)
C134  0.47 uF  [C0402]  -12.96,80.56 0 top  (outside the outline)
C135  0.47 uF  [C0402]  -6.86,69.39 0 top  (outside the outline)
C136  4.7 uF  [C0603]  -12.96,59.23 0 top  (outside the outline)
C137  47 uF  [C1210]  -9.4,93.16 0 top  (outside the outline)
C138  0.47 uF  [C0402]  -16,67.35 0 top  (outside the outline)
C139  4.7 uF  [C0603]  -9.91,59.23 0 top  (outside the outline)
C140  4.7 uF  [C0603]  -16,88.69 0 top  (outside the outline)
C141  4.7 uF  [C0603]  -16,76.5 0 top  (outside the outline)
C142  0.47 uF  [C0402]  -12.96,67.35 0 top  (outside the outline)
C143  0.47 uF  [C0402]  -16,57.19 0 top  (outside the outline)
C144  4.7 uF  [C0603]  -12.96,88.69 0 top  (outside the outline)
C145  4.7 uF  [C0603]  -12.96,76.5 0 top  (outside the outline)
C146  0.47 uF  [C0402]  -9.91,67.35 0 top  (outside the outline)
C147  0.47 uF  [C0402]  -12.96,57.19 0 top  (outside the outline)
C148  4.7 uF  [C0603]  -9.91,88.69 0 top  (outside the outline)
C149  4.7 uF  [C0603]  -9.91,76.5 0 top  (outside the outline)
C150  0.47 uF  [C0402]  -6.86,67.35 0 top  (outside the outline)
C151  0.47 uF  [C0402]  -9.91,57.19 0 top  (outside the outline)
C152  4.7 uF  [C0603]  -16,86.66 0 top  (outside the outline)
C153  4.7 uF  [C0603]  -16,74.47 0 top  (outside the outline)
C154  0.47 uF  [C0402]  -16,65.32 0 top  (outside the outline)
C155  0.47 uF  [C0402]  -16,56.18 0 top  (outside the outline)
C156  4.7 uF  [C0603]  -12.96,86.66 0 top  (outside the outline)
C157  4.7 uF  [C0603]  -12.96,74.47 0 top  (outside the outline)
C158  0.47 uF  [C0402]  -12.96,65.32 0 top  (outside the outline)
C159  0.47 uF  [C0402]  -12.96,56.18 0 top  (outside the outline)
C160  4.7 uF  [C0603]  -9.91,86.66 0 top  (outside the outline)
C161  4.7 uF  [C0603]  -9.91,74.47 0 top  (outside the outline)
C162  0.47 uF  [C0402]  -9.91,65.32 0 top  (outside the outline)
C163  0.47 uF  [C0402]  -6.86,65.32 0 top  (outside the outline)
C164  0.47 uF  [C0402]  -16,63.29 0 top  (outside the outline)
C165  47 uF  [C1210]  42.97,94.18 0 top  (outside the outline)
C166  47 uF  [C1210]  47.95,98.24 0 top  (outside the outline)
C167  47 uF  [C1210]  42.87,98.04 0 top  (outside the outline)
C168  47 uF  [C1210]  47.85,93.97 0 top  (outside the outline)
C169  4.7 uF  [C0603]  34.54,94.79 0 top  (outside the outline)
C170  4.7 uF  [C0603]  33.53,100.88 0 top  (outside the outline)
C171  4.7 uF  [C0603]  20.32,94.79 0 top  (outside the outline)
C172  4.7 uF  [C0603]  20.32,98.85 0 top  (outside the outline)
C173  4.7 uF  [C0603]  6.09,92.75 0 top  (outside the outline)
C174  4.7 uF  [C0603]  7.11,100.88 0 top  (outside the outline)
C175  4.7 uF  [C0603]  34.54,92.75 0 top  (outside the outline)
C176  4.7 uF  [C0603]  33.53,98.85 0 top  (outside the outline)
C177  4.7 uF  [C0603]  20.32,92.75 0 top  (outside the outline)
C178  4.7 uF  [C0603]  20.32,100.88 0 top  (outside the outline)
C179  4.7 uF  [C0603]  6.09,94.79 0 top  (outside the outline)
C180  4.7 uF  [C0603]  7.11,99.87 0 top  (outside the outline)
C181  0.47 uF  [C0402]  29.46,94.79 0 top  (outside the outline)
C182  0.47 uF  [C0402]  29.46,100.88 0 top  (outside the outline)
C183  0.47 uF  [C0402]  16.25,94.79 0 top  (outside the outline)
C184  0.47 uF  [C0402]  16.25,100.88 0 top  (outside the outline)
C185  0.47 uF  [C0402]  0,94.79 0 top  (outside the outline)
C186  0.47 uF  [C0402]  0,99.87 0 top  (outside the outline)
C187  0.47 uF  [C0402]  29.46,93.77 0 top  (outside the outline)
C188  0.47 uF  [C0402]  29.46,99.87 0 top  (outside the outline)
C189  0.47 uF  [C0402]  16.25,93.77 0 top  (outside the outline)
C190  0.47 uF  [C0402]  16.25,99.87 0 top  (outside the outline)
C191  0.47 uF  [C0402]  3.05,94.79 0 top  (outside the outline)
C192  0.47 uF  [C0402]  0,100.88 0 top  (outside the outline)
C193  0.47 uF  [C0402]  26.41,93.77 0 top  (outside the outline)
C194  0.47 uF  [C0402]  26.41,100.88 0 top  (outside the outline)
C195  0.47 uF  [C0402]  13.21,94.79 0 top  (outside the outline)
C196  0.47 uF  [C0402]  13.21,100.88 0 top  (outside the outline)
C197  0.47 uF  [C0402]  0,93.77 0 top  (outside the outline)
C198  0.47 uF  [C0402]  3.05,99.87 0 top  (outside the outline)
C199  0.47 uF  [C0402]  26.41,94.79 0 top  (outside the outline)
C200  0.47 uF  [C0402]  26.41,99.87 0 top  (outside the outline)
C201  0.47 uF  [C0402]  13.21,93.77 0 top  (outside the outline)
C202  0.47 uF  [C0402]  13.21,99.87 0 top  (outside the outline)
C203  0.47 uF  [C0402]  3.05,93.77 0 top  (outside the outline)
C204  0.47 uF  [C0402]  3.05,100.88 0 top  (outside the outline)
C205  22 uF  [C1210]  115.06,95.19 0 top  (outside the outline)
C206  22 uF  [C1210]  136.5,85.24 180 top  (outside the outline)
C207  0.047 uF  [C0402]  132.33,98.85 180 top  (outside the outline)
C208  27pF  [C0402]  127.25,98.85 180 top  (outside the outline)
C209  47 uF  [C1210]  126.24,95.8 180 top  (outside the outline)
C210  47 uF  [C1210]  121.16,95.8 180 top  (outside the outline)
C211  0.1 uF  [C0402]  125.22,76.5 180 top  (outside the outline)
C212  0.1 uF  [C0402]  115.06,64.05 180 top  (outside the outline)
C213  0.1 uF  [C0402]  137.41,79.55 180 top  (outside the outline)
C214  0.1 uF  [C0402]  -49.28,-206.46 0 top  (outside the outline)
C215  0.1 uF  [C0402]  -49.28,-240.75 0 top  (outside the outline)
CN1  HOST  [USB-MINIB]  96.48,28.21 90 top
CN2  HOST  [USB-MINIB]  108.2,35.6 0 top  (outside the outline)
D1  BAT54  [SOT23]  6.81,30.97 270 top
D2  BAT54  [SOT23]  121.16,77.51 90 top  (outside the outline)
D3  BAT54  [SOT23]  111,66.08 90 top  (outside the outline)
D4  BAT54  [SOT23]  133.14,76.9 90 top  (outside the outline)
FB1  600R 500mA  [_0603MP]  75.03,3.65 0 top
FB2  600R 500mA  [_0603MP]  75.33,15.84 0 top
FB3  600R 500mA  [_0603MP]  102.61,17.82 0 top
FB4  600R 500mA  [_0603MP]  106.93,17.32 0 top  (outside the outline)
FB5  0  [1206]  137.41,69.13 0 top  (outside the outline)
FB6  0  [1206]  137.41,54.91 0 top  (outside the outline)
FB7  0  [1206]  121.16,98.85 0 top  (outside the outline)
FID1  FIDUCIAL1X2  [FIDUCIAL-1X2]  86.92,32.3 0 top
FID2  FIDUCIAL1X2  [FIDUCIAL-1X2]  -18.04,2.33 90 top  (outside the outline)
FID3  FIDUCIAL1X2  [FIDUCIAL-1X2]  24.74,13.1 0 top
FID4  FIDUCIAL1X2  [FIDUCIAL-1X2]  89.66,67.66 0 top
FID5  FIDUCIAL1X2  [FIDUCIAL-1X2]  72.59,1.52 0 top
FID6  FIDUCIAL1X2  [FIDUCIAL-1X2]  -13.97,2.33 90 top  (outside the outline)
FID7  FIDUCIAL1X2  [FIDUCIAL-1X2]  -16,4.36 180 top  (outside the outline)
FID8  FIDUCIAL1X2  [FIDUCIAL-1X2]  -16,2.33 180 top  (outside the outline)
FID9  FIDUCIAL1X2  [FIDUCIAL-1X2]  -13.97,4.36 180 top  (outside the outline)
FID10  FIDUCIAL1X2  [FIDUCIAL-1X2]  -11.94,4.36 180 bottom  (outside the outline)
FID11  FIDUCIAL1X2  [FIDUCIAL-1X2]  -11.94,2.33 180 bottom  (outside the outline)
FID12  FIDUCIAL1X2  [FIDUCIAL-1X2]  89.59,67.56 0 bottom
FID13  FIDUCIAL1X2  [FIDUCIAL-1X2]  1.57,7.92 0 top
FID14  FIDUCIAL1X2  [FIDUCIAL-1X2]  -18.04,4.36 90 top  (outside the outline)
FID15  FIDUCIAL1X2  [FIDUCIAL-1X2]  97.89,1.82 0 top
IC1  N25Q128A13ES  [SO08]  89.41,97.58 90 top  (outside the outline)
IC2  74AC244DW  [SO20W]  71.37,86.91 90 top
IC3  N25Q128A13ES  [SO08]  70.86,97.83 270 top  (outside the outline)
IC4  74AC244DW  [SO20W]  -25.15,-130.26 0 top  (outside the outline)
IC5  RCLAMP0502ASC-89  [RCLAMP0502A]  -40.39,-183.6 0 top  (outside the outline)
IC6  RCLAMP0502ASC-89  [RCLAMP0502A]  -49.28,-219.16 0 top  (outside the outline)
J1  STM32-SWD  [100MIL_THT]  67.28,77.97 270 top
J2  [2X3-NS]  -46.74,-198.84 0 top  (outside the outline)
J3  [2X3-NS]  -46.74,-234.4 0 top  (outside the outline)
JP1  5.5x2.1mm Barrel  [POWER_JACK_SMD]  108.96,3.35 90 top  (outside the outline)
JP2  [JP1]  -13.56,11.04 0 top  (outside the outline)
JP3  AVR_SPI_PRG_62X3_LOCK  [2X3_LOCK]  35.4,10.81 180 top
JP4  [1X03_LOCK]  68.02,2.13 180 top
JP5  [1X10_LOCK]  36.62,2.13 0 top
JP6  [JP1]  35.56,16.3 90 top
JP7  [JP1]  76.71,87.42 0 top  (outside the outline)
JP8  [JP1]  -30.23,-109.94 0 top  (outside the outline)
JP9  [JP1]  71.12,97.83 0 top  (outside the outline)
LED1  GREEN  [CHIP-LED0603]  95.83,40.07 270 top
LED2  RED  [CHIP-LED0603]  95.83,37.02 270 top
LED3  BLUE  [CHIP-LED0603]  95.83,41.59 270 top
LED4  YELLOW  [CHIP-LED0603]  95.83,38.54 270 top
LED5  YELLOW  [CHIP-LED0603]  78.39,3.69 270 top
LED6  GREEN  [CHIP-LED0603]  78.38,1.82 270 top
LED7  YELLOW  [CHIP-LED0603]  112.52,19.6 90 top  (outside the outline)
LED8  GREEN  [CHIP-LED0603]  112.52,20.87 90 top  (outside the outline)
LED9  GREEN  [CHIP-LED0603]  58.03,14.54 270 top
LED10  RED  [CHIP-LED0603]  58.03,11.49 270 top
LED11  BLUE  [CHIP-LED0603]  58.03,16.06 270 top
LED12  YELLOW  [CHIP-LED0603]  58.03,13.02 270 top
LED13  RED  [CHIP-LED0603]  -11.94,36.87 90 top  (outside the outline)
LED14  RED  [CHIP-LED0603]  -5.84,48.05 90 top  (outside the outline)
LED15  GREEN  [CHIP-LED0603]  -5.84,46.02 90 top  (outside the outline)
LED16  YELLOW  [CHIP-LED0603]  -5.84,47.03 90 top  (outside the outline)
LED17  BLUE  [CHIP-LED0603]  -5.84,45 90 top  (outside the outline)
LED18  GREEN  [CHIP-LED0603]  115.16,54.5 270 top  (outside the outline)
LOGO1  OSHW-LOGOL-COPPER  [OSHW-LOGO-L_COPPER]  85.26,65.92 0 top
Q1  2N7002  [SOT23]  -9.75,10.72 0 top  (outside the outline)
Q2  BC818  [SOT23-BEC]  16.72,34.53 270 top
Q3  [NX3225]  73.4,24.68 0 top
Q4  2N7002  [SOT23]  -14.99,25.7 0 top  (outside the outline)
Q5  ASFL1  [ASF]  58.67,97.33 0 top  (outside the outline)
Q6  2N7002  [SOT23]  111.3,52.67 90 top  (outside the outline)
R1  56k  [R0402]  129.28,12.49 0 top  (outside the outline)
R2  4.64k  [R0402]  129.28,10.46 0 top  (outside the outline)
R3  100  [R0402]  129.28,8.43 0 top  (outside the outline)
R4  0  [R0402]  -31.5,-116.29 0 top  (outside the outline)
R5  1k  [R0402]  -7.21,9.61 0 top  (outside the outline)
R6  10k  [R0402]  -7.37,10.72 0 top  (outside the outline)
R7  10k  [R0402]  -6.1,17.32 90 top  (outside the outline)
R8  6.3k  [R0402]  119.12,10.46 0 top  (outside the outline)
R9  1.21k  [R0402]  119.12,8.43 0 top  (outside the outline)
R10  470  [R0402]  16.72,31.74 180 top
R11  1k  [R0402]  16.72,24.37 180 top
R12  10k  [R0402]  6.81,28.18 0 top
R13  1k  [R0402]  10.46,31.75 90 top
R14  0  [R0402]  71.12,27.73 180 top
R15  10k  [R0402]  50.04,36.7 90 top
R16  330R  [RESCAXE80P320X160X60-8N]  92.02,39.31 180 top
R17  4.7k  [R0402]  -31.5,-121.37 0 top  (outside the outline)
R18  4.7k  [R0402]  95.5,99.36 180 top  (outside the outline)
R19  10k  [R0402]  69.09,89.45 0 top  (outside the outline)
R20  10k  [R0402]  69.34,91.23 0 top  (outside the outline)
R21  10k  [R0402]  69.85,92.5 0 top  (outside the outline)
R22  12k  [R0402]  86.92,16.45 90 top
R23  10k  [R0402]  88.26,2.44 0 top
R24  330  [R0402]  81.7,3.66 0 top
R25  330  [R0402]  81.7,1.83 0 top
R26  12k  [R0402]  114.04,29.25 90 top  (outside the outline)
R27  10k  [R0402]  105.41,18.84 0 top  (outside the outline)
R28  330  [R0402]  112.27,30.02 0 top  (outside the outline)
R29  330  [R0402]  109.73,30.02 0 top  (outside the outline)
R30  15k  [R0402]  27.63,9.59 270 top
R31  330R  [RESCAXE80P320X160X60-8N]  54.22,13.78 180 top
R32  0  [R0402]  -31.5,-160.74 0 top  (outside the outline)
R33  4.7k  [R0402]  11.94,13.4 180 top
R34  4.7k  [R0402]  4.47,17.06 0 top
R35  1.0k  [R0402]  -14.99,46.02 0 top  (outside the outline)
R36  1.0k  [R0402]  -14.99,43.99 0 top  (outside the outline)
R37  1.0k  [R0402]  -14.99,41.95 0 top  (outside the outline)
R38  330  [R0402]  -8.89,36.87 0 top  (outside the outline)
R39  100  [R0402]  -14.99,36.87 0 top  (outside the outline)
R40  4.7k  [R0402]  -11.94,25.7 0 top  (outside the outline)
R41  4.7k  [R0402]  -8.89,25.7 0 top  (outside the outline)
R42  4.7k  [R0402]  -5.84,25.7 0 top  (outside the outline)
R43  10k  [R0402]  5.33,59.23 0 top
R44  10k  [R0402]  5.33,62.27 0 top
R45  10k  [R0402]  5.33,64.31 0 top
R46  4.7k  [R0402]  -31.5,-99.78 0 top  (outside the outline)
R47  4.7k  [R0402]  -31.5,-104.86 0 top  (outside the outline)
R48  4.7k  [R0402]  -31.5,-94.7 0 top  (outside the outline)
R49  0  [R0402]  58.67,94.28 0 top  (outside the outline)
R50  4.7k  [R0402]  76.96,97.83 0 top  (outside the outline)
R51  4.7k  [R0402]  76.96,99.87 0 top  (outside the outline)
R52  4.7k  [R0402]  120.14,66.08 0 top  (outside the outline)
R53  62k  [R0402]  120.14,68.12 0 top  (outside the outline)
R54  4.7k  [R0402]  120.14,51.86 0 top  (outside the outline)
R55  62k  [R0402]  120.14,53.89 0 top  (outside the outline)
R56  205k  [R0402]  132.33,67.1 0 top  (outside the outline)
R57  147k  [R0402]  132.33,71.16 0 top  (outside the outline)
R58  205k  [R0402]  132.33,54.91 0 top  (outside the outline)
R59  59k  [R0402]  132.33,52.88 0 top  (outside the outline)
R60  470  [R0402]  132.33,69.13 0 top  (outside the outline)
R61  470  [R0402]  132.33,48.81 0 top  (outside the outline)
R62  0  [R0603]  -31.5,-165.82 0 top  (outside the outline)
R63  0  [R0603]  -31.5,-170.9 0 top  (outside the outline)
R64  330R  [RESCAXE80P320X160X60-8N]  -2.54,46.53 0 top
R65  1.0k  [R0402]  -15.29,31.9 0 top  (outside the outline)
R66  4.7k  [R0402]  135.38,90.72 0 top  (outside the outline)
R67  0  [R0402]  132.33,96.82 180 top  (outside the outline)
R68  150k  [R0402]  135.38,96.82 180 top  (outside the outline)
R69  226k  [R0402]  135.38,98.85 180 top  (outside the outline)
R70  100  [R0402]  135.48,94.48 180 top  (outside the outline)
R71  0  [R0603]  -31.5,-175.98 0 top  (outside the outline)
R72  100k  [R0402]  125.22,78.53 0 top  (outside the outline)
R73  4.7k  [R0402]  115.06,68.12 180 top  (outside the outline)
R74  100k  [R0402]  115.06,66.08 0 top  (outside the outline)
R75  4.7k  [R0402]  137.41,77.51 180 top  (outside the outline)
R76  100k  [R0402]  137.41,75.48 0 top  (outside the outline)
R77  4.7k  [R0402]  115.06,50.84 180 top  (outside the outline)
R78  330  [R0402]  115.06,52.88 0 top  (outside the outline)
R79  4.7k  [R0402]  -22.61,-145.5 0 top  (outside the outline)
R80  4.7k  [R0402]  -31.5,-150.58 0 top  (outside the outline)
R81  4.7k  [R0402]  -25.15,-150.58 0 top  (outside the outline)
R82  15k  [R0402]  -31.5,-155.66 0 top  (outside the outline)
R83  0  [R0603]  -31.5,-181.06 0 top  (outside the outline)
R84  0  [R0603]  -31.5,-186.14 0 top  (outside the outline)
R85  0  [R0603]  -31.5,-191.22 0 top  (outside the outline)
R86  100  [R0402]  -40.39,-196.3 0 top  (outside the outline)
R87  100  [R0402]  -40.39,-201.38 0 top  (outside the outline)
R88  100  [R0402]  -49.28,-245.83 0 top  (outside the outline)
R89  100  [R0402]  -44.2,-245.83 0 top  (outside the outline)
R90  10k  [R0402]  -49.28,-250.91 0 top  (outside the outline)
R91  10k  [R0402]  -49.28,-255.99 0 top  (outside the outline)
S1  SHIELDING CABINET  [WE-SHC_36103205_NO_CREAM]  12.66,31.6 180 top
S2  TACTILE_SWITCH  [TACTILE_SWITCH]  6.45,4.57 90 top
SV1  [MA08-1]  2.28,58.21 270 top
SV2  [MA08-2]  12.44,76.5 0 top
SV3  [MA08-2]  46.99,76.5 0 top
T1  BC847  [SOT23]  16.72,28.94 270 top
T2  BC847  [SOT23]  6.81,25.39 270 top
TP1  TPB1,27  [B1,27]  15.96,25.89 270 top
TP2  TPB1,27  [B1,27]  9.3,28.18 270 top
U1  LMZ13608  [NDY]  125.42,17.98 0 top  (outside the outline)
U2  LT3060ITS8-15  [TSOT-8-23]  -8.89,16.55 270 top  (outside the outline)
U3  MC74HC1G14DTT1G  [SOT95P275X110-5N]  6.97,35.8 90 top
U4  STM32F429BIT6  [LQFP-208]  70,45 90 top
U5  IS45S32160F  [TSOP2-86L]  -27.18,12.74 0 top  (outside the outline)
U6  IS45S32160F  [TSOP2-86L]  -27.18,-44.15 0 top  (outside the outline)
U7  MCP79412-I/SN  [SOIC127P600X175-8N]  64.97,9.44 0 top
U8  FT232H_SERIAL  [FT2323HL_LQFP48]  85.7,9.75 180 top
U9  FT232H_SERIAL  [FT2323HL_LQFP48]  105.66,25.7 0 top
U10  ATTINY828R-AU  [QFP80P900X900X120-32N]  46.83,12.19 90 top
U12  23K640-I/SN  [SOIC127P600X175-8N']  6.45,12.8 0 top
U13  XC7A200TFBG484  [FF484]  29.51,56.99 270 top
U14  EN6347QI  [QFN38_4X7X1.85]  126.64,67.51 0 top  (outside the outline)
U15  EN6347QI  [QFN38_4X7X1.85]  126.24,52.88 0 top  (outside the outline)
U16  EN5364QI  [QFN68_8X11X1.85]  125.52,89.1 0 top  (outside the outline)
X1  [XTAL3215]  65.02,14.52 180 top
Y1  12 MHz  [CRYSTAL_3.2X2.5]  90.27,17.37 90 top
Y2  12 MHz  [CRYSTAL_3.2X2.5]  105.66,25.95 0 top  (outside the outline)